# EAGLE design EXPquad (EAGLE 5.11)
PARTNO: RMCF0402FT10K0
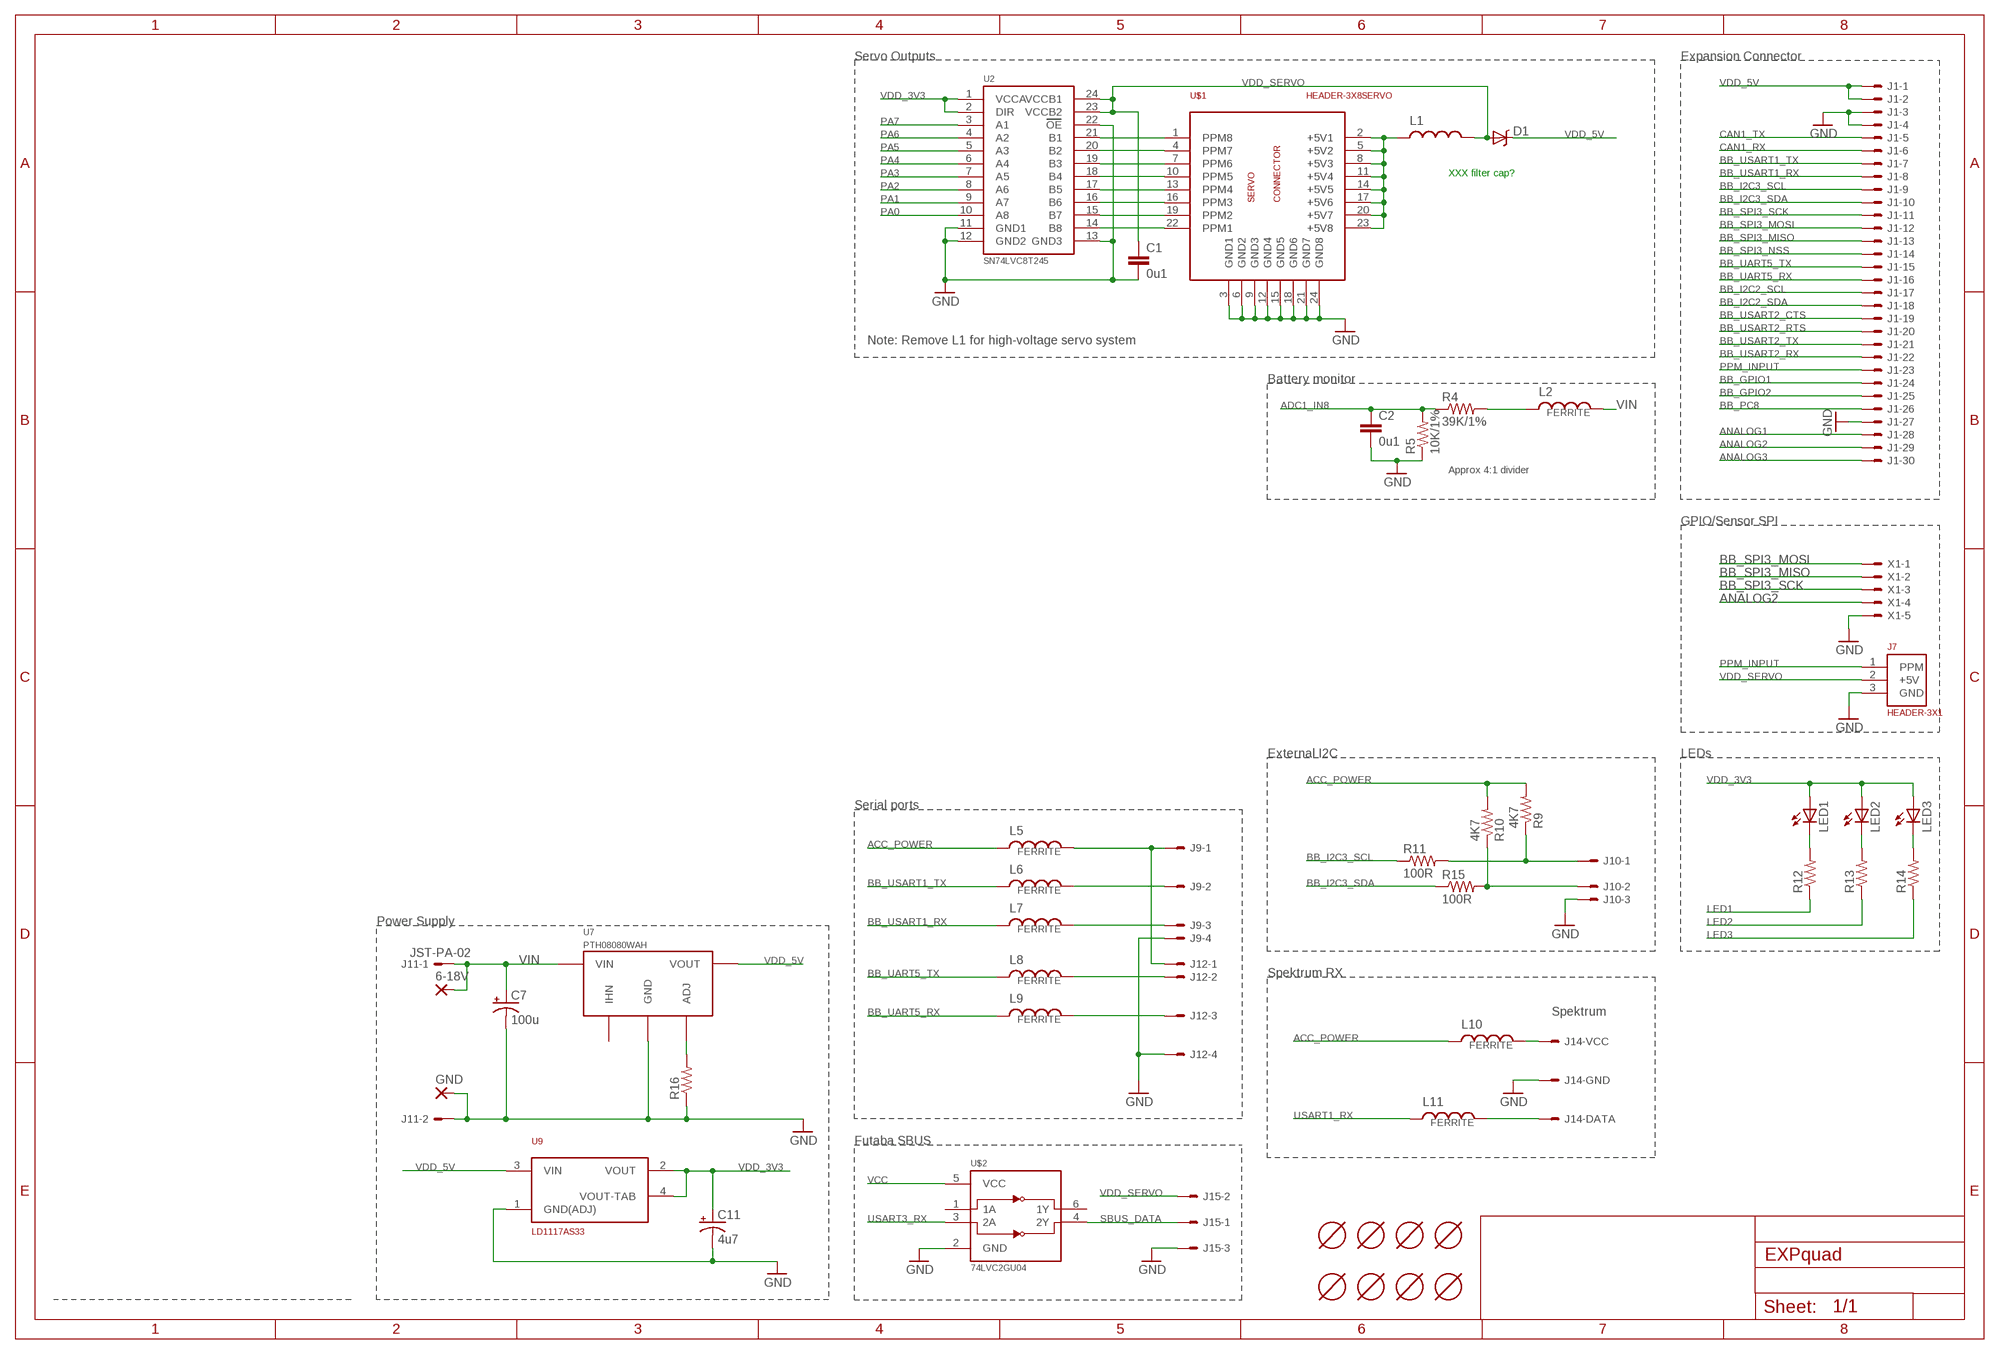
[diagram p0: schematic, sheet 1]

## Parts
6-18V  WIREPADSMD3,5-2  [3,5-2]
C1  0u1  CAP0402-CAP  [0402-CAP]
C2  0u1  CAP0402-CAP  [0402-CAP]
C7  100u  CAP_POL7343  [EIA7343]
C11  4u7  CAP_POL1206  [EIA3216]
D1  DIODE-SCHOTTKY_MSMP  [MICROSMP]
GND  WIREPADSMD3,5-2  [3,5-2]
J1  HEADER_2X15-REV  [HEADER_2MM_2X15_REVERSE]
J7  HEADER-3X1  [3X1RA]
J9  53261-04  [53261-04]
J10  53047-03  [53047-03]
J11  JST-PA-02  [JST-S02B-PASK-2]
J12  53261-04  [53261-04]
J14  Spektrum  SPEKTRUM_RX_CONN  [S3B-ZR-SM4A-TF]
J15  53047-03  [53047-03]
L1  INDUCTOR0402  [0402-IND]
L2  FERRITE  INDUCTOR0402  [0402-IND]
L5  FERRITE  INDUCTOR0402  [0402-IND]
L6  FERRITE  INDUCTOR0402  [0402-IND]
L7  FERRITE  INDUCTOR0402  [0402-IND]
L8  FERRITE  INDUCTOR0402  [0402-IND]
L9  FERRITE  INDUCTOR0402  [0402-IND]
L10  FERRITE  INDUCTOR0402  [0402-IND]
L11  FERRITE  INDUCTOR0402  [0402-IND]
LED1  LED0603  [LED-0603]
LED2  LED0603  [LED-0603]
LED3  LED0603  [LED-0603]
R4  39K/1%  RESISTOR0402-RES  [0402-RES]
R5  10K/1%  RESISTOR0402-RES  [0402-RES]
R9  4K7  RESISTOR0402-RES  [0402-RES]
R10  4K7  RESISTOR0402-RES  [0402-RES]
R11  100R  RESISTOR0402-RES  [0402-RES]
R12  RESISTOR0402-RES  [0402-RES]
R13  RESISTOR0402-RES  [0402-RES]
R14  RESISTOR0402-RES  [0402-RES]
R15  100R  RESISTOR0402-RES  [0402-RES]
R16  RESISTOR0402-RES  [0402-RES]
U2  SN74LVC8T245  [R-PDSO-G24]
U7  PTH08080WAH  [PTH08080W_TH]
U9  LD1117AS33  [SOT-223]
U$1  HEADER-3X8SERVO  [3X8RA]
U$2  74LVC2GU04  [SOT363_PHILIPS]
U$3  MOUNT-HOLE2.1MM  [MOUNT-HOLE2.1]
U$4  MOUNT-HOLE2.1MM  [MOUNT-HOLE2.1]
U$5  MOUNT-HOLE2.1MM  [MOUNT-HOLE2.1]
U$6  MOUNT-HOLE2.1MM  [MOUNT-HOLE2.1]
U$7  MOUNT-HOLE3.1MM  [MOUNT-HOLE3.1]
U$8  MOUNT-HOLE3.1MM  [MOUNT-HOLE3.1]
U$9  MOUNT-HOLE3.1MM  [MOUNT-HOLE3.1]
U$10  MOUNT-HOLE3.1MM  [MOUNT-HOLE3.1]
X1  53047-05  [53047-05]

## Nets
ACC_POWER: L5.1 L10.1 R9.2 R10.2
ADC1_IN8: C2.1 R4.1 R5.2
ANALOG1: J1.28
ANALOG2: J1.29 X1.4
ANALOG3: J1.30
BB_GPIO1: J1.24
BB_GPIO2: J1.25
BB_I2C2_SCL: J1.17
BB_I2C2_SDA: J1.18
BB_I2C3_SCL: J1.9 R11.1
BB_I2C3_SDA: J1.10 R15.1
BB_PC8: J1.26
BB_SPI3_MISO: J1.13 X1.2
BB_SPI3_MOSI: J1.12 X1.1
BB_SPI3_NSS: J1.14
BB_SPI3_SCK: J1.11 X1.3
BB_UART5_RX: J1.16 L9.1
BB_UART5_TX: J1.15 L8.1
BB_USART1_RX: J1.8 L7.1
BB_USART1_TX: J1.7 L6.1
BB_USART2_CTS: J1.19
BB_USART2_RTS: J1.20
BB_USART2_RX: J1.22
BB_USART2_TX: J1.21
CAN1_RX: J1.6
CAN1_TX: J1.5
GND: C1.2 C2.2 C7.C(-) C11.C(-) GND.1(P) J1.3 J1.4 J1.27 J7.3(GND) J9.4 J10.3 J11.2 J12.4 J14.P$2 J15.3 R5.1 R16.1 U2.11(GND1) U2.12(GND2) U2.13(GND3) U2.22(OE) U7.2(GND) U9.1(GND(ADJ)) U$1.3(GND1) U$1.6(GND2) U$1.9(GND3) U$1.12(GND4) U$1.15(GND5) U$1.18(GND6) U$1.21(GND7) U$1.24(GND8) U$2.2(GND)
J6-DATA: J14.P$3 L11.2
LED1: R12.1
LED2: R13.1
LED3: R14.1
N$3: J9.1 J12.1 L5.2
N$4: J14.P$1 L10.2
N$7: L2.1 R4.2
N$8: LED1.C R12.2
N$9: R16.2 U7.4(ADJ)
N$19: J12.3 L9.2
N$25: J12.2 L8.2
N$26: J9.3 L7.2
N$27: J10.2 R10.1 R15.2
N$28: J10.1 R9.1 R11.2
N$31: LED2.C R13.2
N$38: LED3.C R14.2
N$41: J9.2 L6.2
PA0: U2.10(A8)
PA1: U2.9(A7)
PA2: U2.8(A6)
PA3: U2.7(A5)
PA4: U2.6(A4)
PA5: U2.5(A3)
PA6: U2.4(A2)
PA7: U2.3(A1)
PPM1: U2.14(B8) U$1.22(PPM1)
PPM2: U2.15(B7) U$1.19(PPM2)
PPM3: U2.16(B6) U$1.16(PPM3)
PPM4: U2.17(B5) U$1.13(PPM4)
PPM5: U2.18(B4) U$1.10(PPM5)
PPM6: U2.19(B3) U$1.7(PPM6)
PPM7: U2.20(B2) U$1.4(PPM7)
PPM8: U2.21(B1) U$1.1(PPM8)
PPM_INPUT: J1.23 J7.1(PPM)
SBUS_DATA: J15.1 U$2.4(2Y)
SERVO_5V: L1.1 U$1.2(+5V1) U$1.5(+5V2) U$1.8(+5V3) U$1.11(+5V4) U$1.14(+5V5) U$1.17(+5V6) U$1.20(+5V7) U$1.23(+5V8)
USART1_RX: L11.1
USART3_RX: U$2.3(2A)
VCC: U$2.5(VCC)
VDD_3V3: C11.A(+) LED1.A LED2.A LED3.A U2.1(VCCA) U2.2(DIR) U9.2(VOUT) U9.4(VOUT-TAB)
VDD_5V: D1.CATHODE(C) J1.1 J1.2 U7.3(VOUT) U9.3(VIN)
VDD_SERVO: C1.1 D1.ANODE(A) J7.2(+5V) J15.2 L1.2 U2.23(VCCB2) U2.24(VCCB1)
VIN: 6-18V.1(P) C7.A(+) J11.1 L2.2 U7.1(VIN)
Unconnected: U7.5(IHN) U$2.1(1A) U$2.6(1Y) X1.5

## Notes on the sheet
- Servo Outputs | Expansion Connector
- XXX filter cap?
- Note: Remove L1 for high-voltage servo system
- Battery monitor
- Approx 4:1 divider
- GPIO/Sensor SPI
- External I2C | LEDs
- Serial ports
- Power Supply
- Spektrum RX
- Spektrum
- Futaba SBUS

## Library data of the parts
6-18V GND = pixhawk2:WIREPAD: Wire PAD connect wire on PCB
C1 C2 = pixhawk2:CAP: Capacitor Standard 0603 ceramic capacitor, and 0.1" leaded capacitor.
C7 C11 = pixhawk2:CAP_POL: Capacitor Polarized These are standard SMD and PTH capacitors. Normally 10uF, 47uF, and 100uF in electrolytic and tantalum varieties. Always verify the external diameter of the through hole cap, it varies with capacity, voltage, and manufacturer. The EIA devices should be standard.
D1 = pixhawk2:DIODE-SCHOTTKY: Schottky barrier diode in DO214AC, e.g. Fairchild SS14.
J1 = pixhawk2:HEADER_2X15: 2X15 header
J7 = pixhawk2:HEADER-3X1
J9 J12 = pixhawk2:53?-04: CONNECTOR wire to board 1.25 mm (.049 inch) pitch header
J10 J15 = pixhawk2:53?-03: CONNECTOR wire to board 1.25 mm (.049 inch) pitch header
J11 = pixhawk2-import:JST-PA-02: JST PA Series http://www.jst-mfg.com/product/pdf/eng/ePA-F.pdf
J14 = pixhawk2:SPEKTRUM_RX_CONN: Spektrum RX connector; JST ZH series S3B-ZR-SM4A-TF
L1 L2 L5-L11 = pixhawk2:INDUCTOR: Inductors Basic Inductor/Choke - 0603 and 1206. Footprints are not proven and vary greatly between part numbers.
LED1-LED3 = pixhawk2:LED: LEDs Standard schematic elements and footprints for 5mm, 3mm, 1206, and 0603 sized LEDs. 5mm - Spark Fun Electronics SKU : COM-00529 (and others)
R4 R5 R9-R16 = pixhawk2:RESISTOR: Resistor Basic schematic elements and footprints for 0603, 1206, and PTH 1/10th watt (small) resistors.
U2 = pixhawk2:SN74LVC8T245
U7 = pixhawk2:PTH08080W: 2.25-A, WIDE-INPUT ADJUSTABLE SWITCHING REGULATOR The input voltage range of the PTH08080W is from 4.5 V to 18 V, allowing operation from either a 5-V or 12-V input bus. Using state-of-the-art switched-mode power-conversion technology, the PTH08080W can step down to voltages as low as 0.9 V from a 5-V input bus, with less than 1 W of power dissipation. The output voltage can be adjusted to any voltage over the range, 0.9 V to 5.5 V, using a single external resistor. Operating features include an undervoltage lockout (UVLO), on/off inhibit, overcurrent protection, and overtemperature protection. http://focus.ti.com/lit/ds/symlink/pth08080w.pdf
U9 = pixhawk2:LD1117A: LD1117A LDO Datasheet: http://www.st.com/stonline/books/pdf/docs/7194.pdf
U$1 = pixhawk2:HEADER-3X8
U$2 = pixhawk2:74LVC2GU04: DUAL INVERTER GATE This dual inverter is designed for 1.65-V to 5.5-V VCC operation. The SN74LVC2GU04 contains two inverters with unbuffered outputs and performs the Boolean function Y = A. It is available from NXP and TI. http://www.nxp.com/documents/data_sheet/74LVC2GU04.pdf http://focus.ti.com/lit/ds/symlink/sn74lvc2gu04.pdf
U$3-U$10 = pixhawk2:MOUNT-HOLE
X1 = pixhawk2:53?-05: CONNECTOR wire to board 1.25 mm (.049 inch) pitch header

## Net classes
1 power: width 0.254 mm, drill 0.3 mm, clearance 0.203 mm

## Board
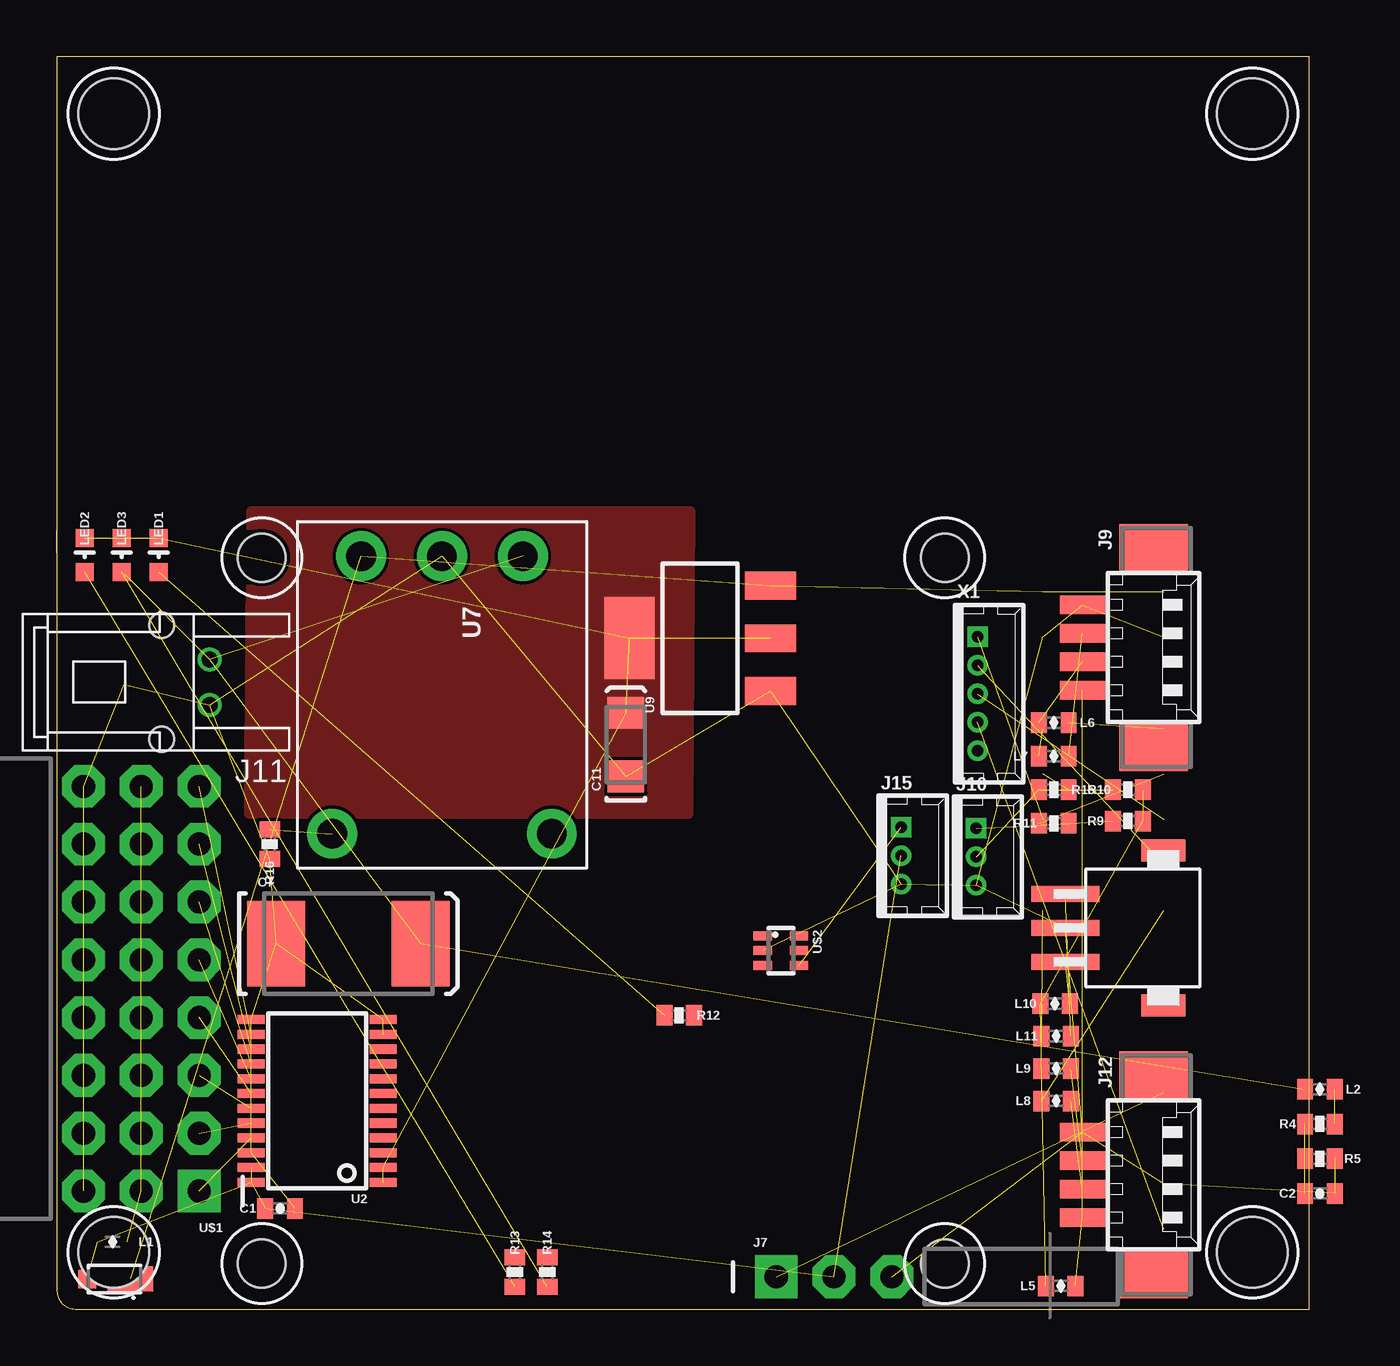
[diagram p1: board, top side]
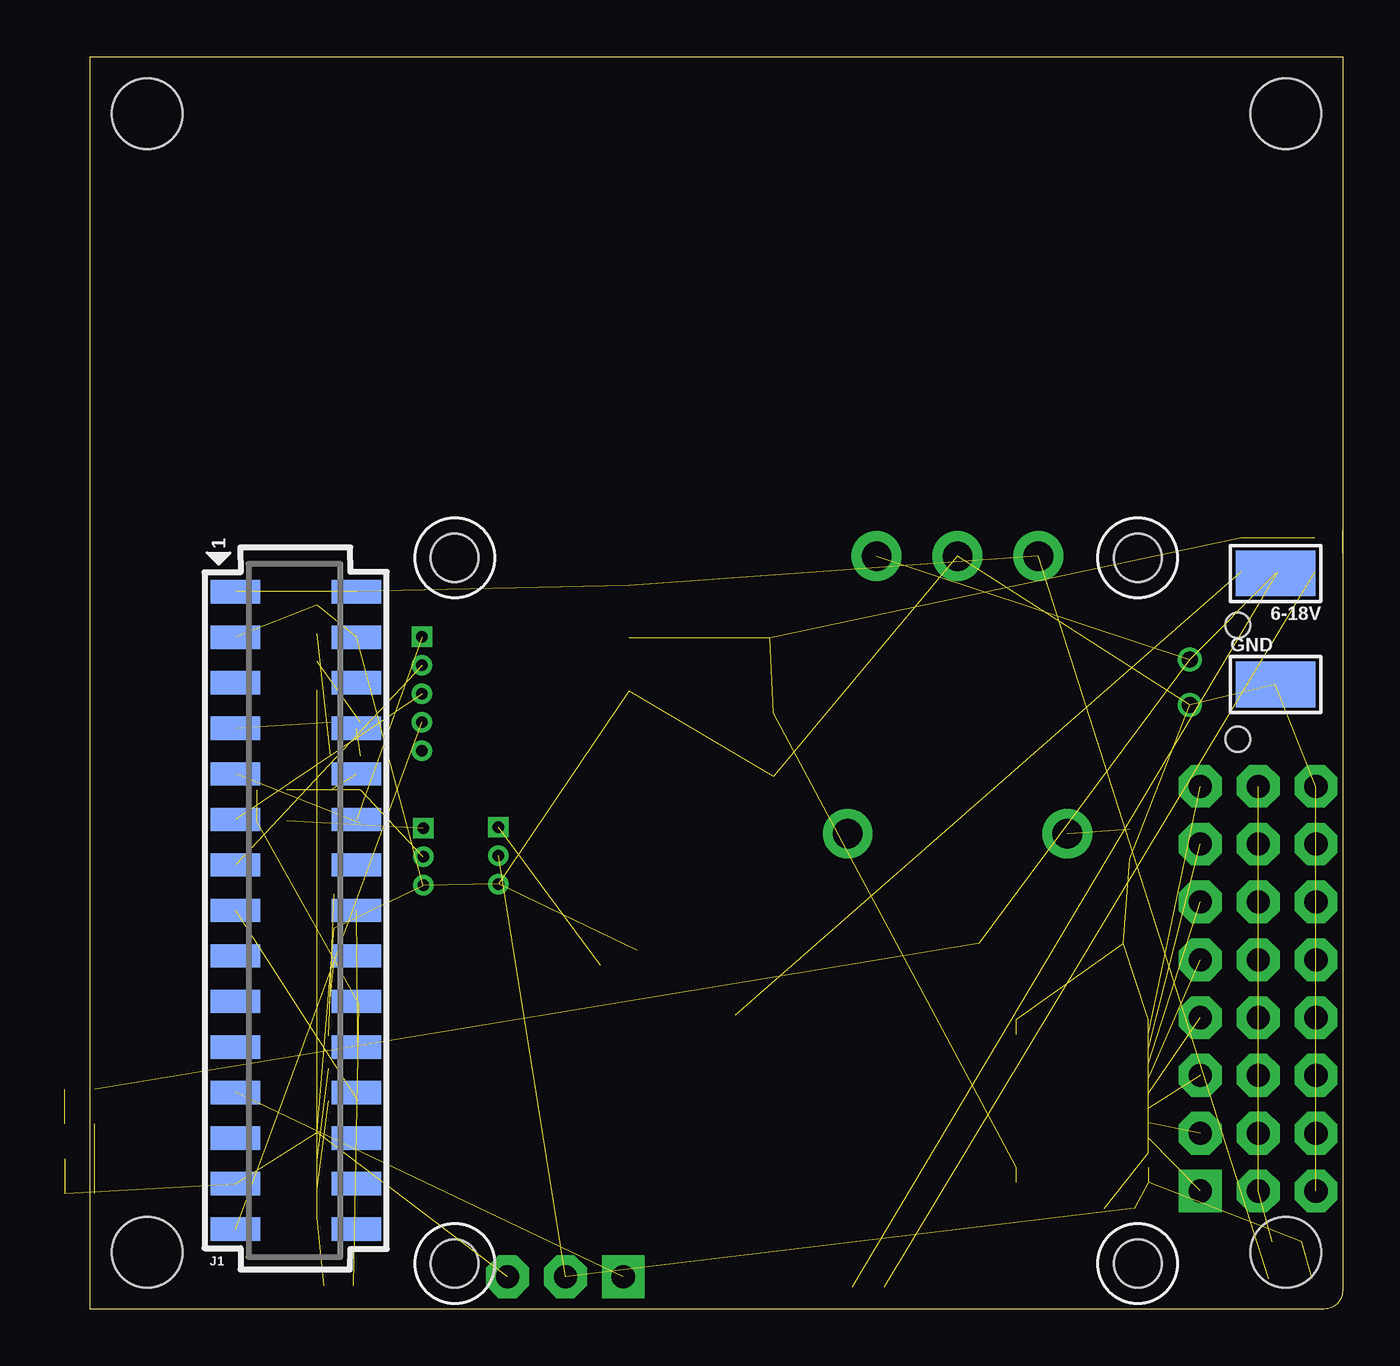
[diagram p2: board, bottom side, seen from below]

Size 55 x 55 mm. Coordinates in mm from the lower left corner, seen from the top.
Outline: 0,33.2 0,34.2
Outline: 55,55 0,55 0,0.8 arc90 0.8,0 55,0 55,55
Copper layers (1*16): Top 0.035mm / dielectric 1.5mm / Bottom 0.035mm
Design rules "Multipcb-BGA": minimum track width 0.15mm, minimum drill 0.2mm, track to track 0.15mm, track to pad 0.15mm, pad to pad 0.15mm, via to via 0.15mm, smd to smd 0.15mm, copper to edge 0.2mm, drill to drill 0.2mm, minimum pad ring 0.125mm, minimum via ring 0.125mm, stop-mask expansion 3mil, vias tented up to drill 0mil, thermal gap 8mil

### Footprints (pad centres in the part's own frame; a part is rotated, then mirrored left to right if it is on the bottom)
3,5-2 = smd 2 x 3.5: 1 0,0
0402-CAP = smd 0.7 x 0.9: 1 -0.65,0; 2 0.65,0
EIA7343 = smd 2.55 x 3.75: A 3.17,0; C -3.17,0
EIA3216 = smd 1.4 x 1.6: A 1.4,0; C -1.4,0
MICROSMP = smd 0.8 x 0.8: ANODE 0.65,0 | smd 2 x 1.1: CATHODE -1.25,0
HEADER_2MM_2X15_REVERSE = smd 1.02 x 2.16: 1 -14,-2.655; 2 -14,2.655; 3 -12,-2.655; 4 -12,2.655; 5 -10,-2.655; 6 -10,2.655; 7 -8,-2.655; 8 -8,2.655; 9 -6,-2.655; 10 -6,2.655; 11 -4,-2.655; 12 -4,2.655; 13 -2,-2.655; 14 -2,2.655; 15 0,-2.655; 16 0,2.655; 17 2,-2.655; 18 2,2.655; 19 4,-2.655; 20 4,2.655; 21 6,-2.655; 22 6,2.655; 23 8,-2.655; 24 8,2.655; 25 10,-2.655; 26 10,2.655; 27 12,-2.655; 28 12,2.655; 29 14,-2.655; 30 14,2.655
3X1RA = drill 1.016 pad 1.88 square: 1 -5.08,0 | drill 1.016 pad 1.88 octagon: 2 -2.54,0; 3 0,0
53261-04 = smd 0.8 x 2: 1 1.875,-2.5; 2 0.625,-2.5; 3 -0.625,-2.5; 4 -1.875,-2.5 | smd 2.1 x 3: S1 4.375,0.625; S2 -4.375,0.625
53047-03 = drill 0.5 pad 0.9 square: 1 -1.25,0 | drill 0.5 pad 0.9 round: 2 0,0; 3 1.25,0
JST-S02B-PASK-2 = drill 0.7 round: 1 1,0; 2 -1,0 | hole 1.1: -2.5,2.1; 2.5,2.1
S3B-ZR-SM4A-TF@1 = smd 0.7 x 3: P$1 0,0; P$2 1.5,0; P$3 3,0 | smd 0.965 x 1.93: P$10 4.9,-4.3; P$20 -1.9,-4.3
0402-IND = smd 0.7 x 0.9: 1 -0.65,0; 2 0.65,0
LED-0603 = smd 0.8 x 0.8: A 0,-0.75; C 0,0.75
0402-RES = smd 0.7 x 0.9: 1 -0.65,0; 2 0.65,0
R-PDSO-G24 = smd 0.4 x 1.2: 1 -3.575,-2.9; 2 -2.925,-2.9; 3 -2.275,-2.9; 4 -1.625,-2.9; 5 -0.975,-2.9; 6 -0.325,-2.9; 7 0.325,-2.9; 8 0.975,-2.9; 9 1.625,-2.9; 10 2.275,-2.9; 11 2.925,-2.9; 12 3.575,-2.9; 13 3.575,2.9; 14 2.925,2.9; 15 2.275,2.9; 16 1.625,2.9; 17 0.975,2.9; 18 0.325,2.9; 19 -0.325,2.9; 20 -0.975,2.9; 21 -1.625,2.9; 22 -2.275,2.9; 23 -2.925,2.9; 24 -3.575,2.9
PTH08080W_TH = drill 1.3 pad 2.184 round: 1 -6.096,3.556; 2 -6.096,0; 3 -6.096,-3.556; 4 6.096,-4.826; 5 6.096,4.826
SOT-223 = smd 1.219 x 2.235: 1 -2.311,-3.099; 2 0,-3.099; 3 2.311,-3.099 | smd 3.6 x 2.2: 4 0,3.099
3X8RA = drill 1.016 pad 1.88 square: 1 -1.27,8.89 | drill 1.016 pad 1.88 octagon: 2 1.27,8.89; 3 3.81,8.89; 4 -1.27,6.35; 5 1.27,6.35; 6 3.81,6.35; 7 -1.27,3.81; 8 1.27,3.81; 9 3.81,3.81; 10 -1.27,1.27; 11 1.27,1.27; 12 3.81,1.27; 13 -1.27,-1.27; 14 1.27,-1.27; 15 3.81,-1.27; 16 -1.27,-3.81; 17 1.27,-3.81; 18 3.81,-3.81; 19 -1.27,-6.35; 20 1.27,-6.35; 21 3.81,-6.35; 22 -1.27,-8.89; 23 1.27,-8.89; 24 3.81,-8.89
SOT363_PHILIPS = smd 0.4 x 0.8: 1 -0.65,-0.8; 2 0,-0.8; 3 0.65,-0.8; 4 0.65,0.8; 5 0,0.8; 6 -0.65,0.8
MOUNT-HOLE2.1 = hole 2.1: 0,0
MOUNT-HOLE3.1 = hole 3.1: 0,0
53047-05 = drill 0.5 pad 0.9 square: 1 -2.5,0 | drill 0.5 pad 0.9 round: 2 -1.25,0; 3 0,0; 4 1.25,0; 5 2.5,0

### Placement (x,y rotation side)
6-18V  2.95,32.31 90 bottom
C1  9.8,4.42 0 top
C2  55.47,5.08 0 top
C7  12.8,16.05 0 top
C11  24.99,24.79 90 top
D1  1.98,1.32 180 top
GND  2.95,27.43 270 bottom
J1  45.97,17.51 270 bottom
J7  36.68,1.42 0 top
J9  47.55,29.06 270 top
J10  40.39,19.86 270 top
J11  6.71,27.53 90 top
J12  47.55,5.89 270 top
J14  Spektrum  [S3B-ZR-SM4A-TF@1]  44.3,15.24 90 top
J15  37.08,19.91 270 top
L1  2.44,2.95 180 top
L2  55.47,9.65 180 top
L5  44.09,1.02 0 top
L6  43.79,25.76 180 top
L7  43.79,24.28 0 top
L8  43.89,9.14 0 top
L9  43.89,10.57 0 top
L10  43.84,13.41 0 top
L11  43.89,11.99 0 top
LED1  4.47,33.12 180 top
LED2  1.22,33.12 180 top
LED3  2.84,33.12 180 top
R4  55.47,8.13 0 top
R5  55.47,6.6 180 top
R9  47.04,21.44 0 top
R10  47.04,22.81 0 top
R11  43.79,21.34 0 top
R12  27.33,12.9 180 top
R13  20.12,1.63 270 top
R14  21.54,1.63 270 top
R15  43.79,22.81 180 top
R16  9.35,20.42 90 top
U2  11.43,9.14 90 top
U7  16.92,26.97 270 top
U9  28.24,29.46 90 top
U$1  4.98,14.07 180 top
U$2  31.8,15.75 270 top
U$3  39,33 0 top
U$4  9,33 0 top
U$5  39,2 0 top
U$6  9,2 0 top
U$7  2.5,52.5 0 top
U$8  52.5,52.5 0 top
U$9  2.5,2.5 0 top
U$10  52.5,2.5 0 top
X1  40.44,27.03 270 top

### Tracks (layer width: path | path; a pad name or v marks a point on that pad's centre or on a via)
ACC_POWER  (3 unrouted)
ADC1_IN8  (2 unrouted)
ANALOG2  (1 unrouted)
BB_I2C3_SCL  (1 unrouted)
BB_I2C3_SDA  (1 unrouted)
BB_SPI3_MISO  (1 unrouted)
BB_SPI3_MOSI  (1 unrouted)
BB_SPI3_SCK  (1 unrouted)
BB_UART5_RX  (1 unrouted)
BB_UART5_TX  (1 unrouted)
BB_USART1_RX  (1 unrouted)
BB_USART1_TX  (1 unrouted)
GND  (31 unrouted)
J6-DATA  (1 unrouted)
N$3  (2 unrouted)
N$4  (1 unrouted)
N$7  (1 unrouted)
N$8  (1 unrouted)
N$9  (1 unrouted)
N$19  (1 unrouted)
N$25  (1 unrouted)
N$26  (1 unrouted)
N$27  (2 unrouted)
N$28  (2 unrouted)
N$31  (1 unrouted)
N$38  (1 unrouted)
N$41  (1 unrouted)
PPM1  (1 unrouted)
PPM2  (1 unrouted)
PPM3  (1 unrouted)
PPM4  (1 unrouted)
PPM5  (1 unrouted)
PPM6  (1 unrouted)
PPM7  (1 unrouted)
PPM8  (1 unrouted)
PPM_INPUT  (1 unrouted)
SBUS_DATA  (1 unrouted)
SERVO_5V  (8 unrouted)
VDD_3V3  (7 unrouted)
  pour Top (no thermals): 8.53,35.05 27.84,35.05 27.74,21.74 8.43,21.74
VDD_5V  (4 unrouted)
VDD_SERVO  (6 unrouted)
VIN  (4 unrouted)

### Text on the board
tDocu: S1 | RST | BOOT | S8
bDocu: SERVO 1